# EAGLE design eki-igep (EAGLE 5.10)
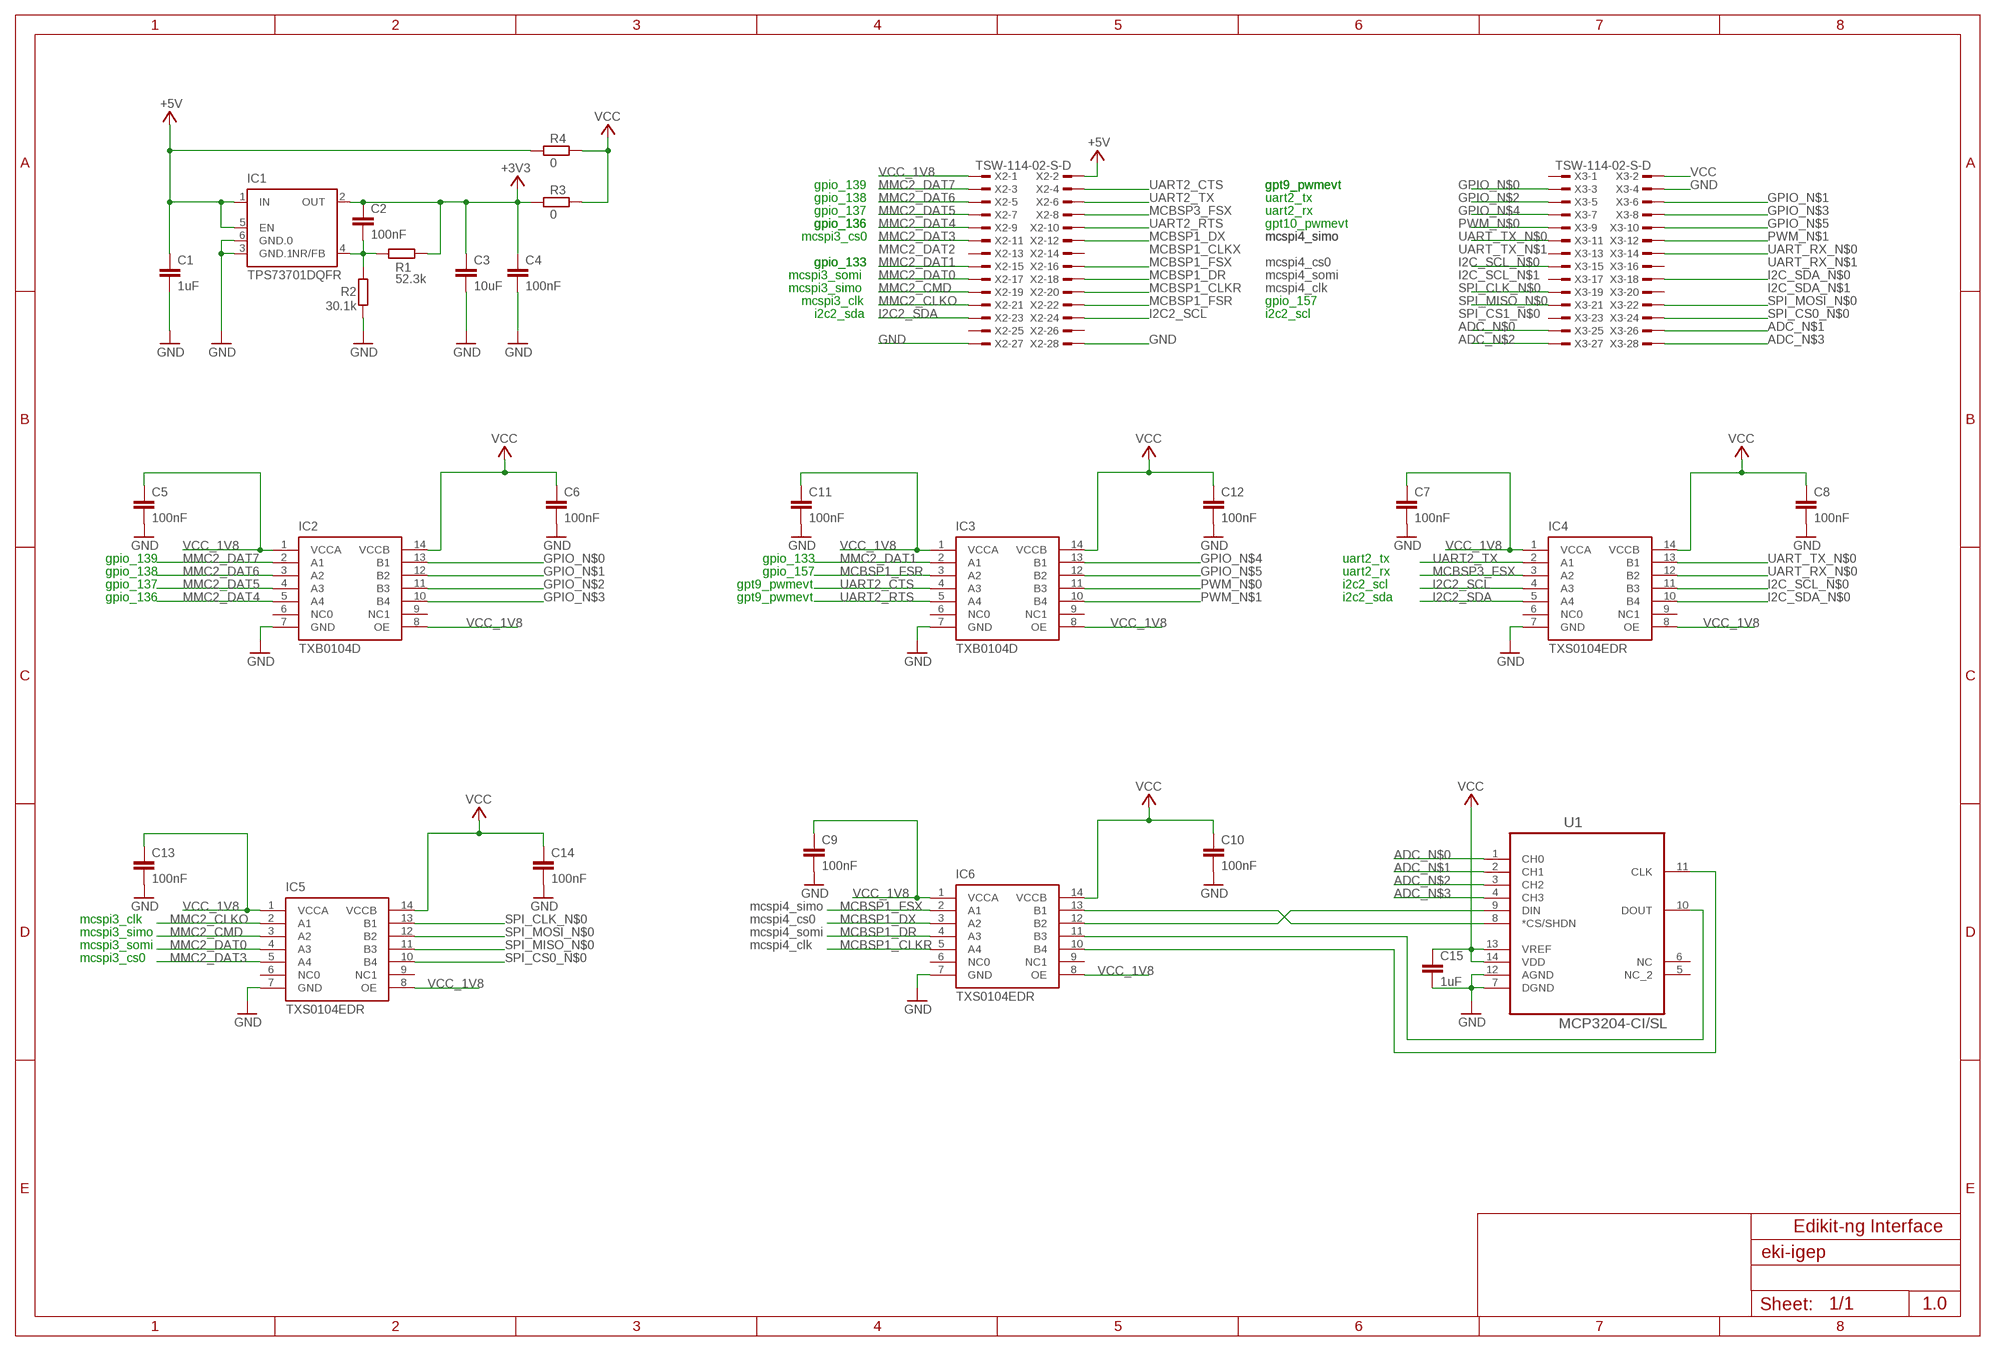
[diagram p0: schematic, sheet 1]

## Parts
C1  1uF  C-EUC0805  [C0805]
C2  100nF  C-EUC0805  [C0805]
C3  10uF  C-EUC0805  [C0805]
C4  100nF  C-EUC0805  [C0805]
C5  100nF  C-EUC0805  [C0805]
C6  100nF  C-EUC0805  [C0805]
C7  100nF  C-EUC0805  [C0805]
C8  100nF  C-EUC0805  [C0805]
C9  100nF  C-EUC0805  [C0805]
C10  100nF  C-EUC0805  [C0805]
C11  100nF  C-EUC0805  [C0805]
C12  100nF  C-EUC0805  [C0805]
C13  100nF  C-EUC0805  [C0805]
C14  100nF  C-EUC0805  [C0805]
C15  1uF  C-EUC0805  [C0805]
IC1  TPS73701DQFR  [SOT223-6]
IC2  TXB0104D  [D_R-PDSO-G14]
IC3  TXB0104D  [D_R-PDSO-G14]
IC4  TXS0104EDR  [D_R-PDSO-G14]
IC5  TXS0104EDR  [D_R-PDSO-G14]
IC6  TXS0104EDR  [D_R-PDSO-G14]
R1  52.3k  R-EU_R1206  [R1206]
R2  30.1k  R-EU_R1206  [R1206]
R3  0  R-EU_R1206  [R1206]
R4  0  R-EU_R1206  [R1206]
U1  MCP3204-CI/SL  [SOIC127P600X175-14N]
X2  TSW-114-02-S-D  [TSW-114-02-S-D]
X3  TSW-114-02-S-D  [TSW-114-02-S-D]

## Nets
+3V3: C2.2 C3.1 C4.1 IC1.2(OUT) R1.2 R3.1
+5V: C1.1 IC1.1(IN) IC1.5(EN) R4.1 X2.2
ADC_N$0: U1.1(CH0) X3.25
ADC_N$1: U1.2(CH1) X3.26
ADC_N$2: U1.3(CH2) X3.27
ADC_N$3: U1.4(CH3) X3.28
GND: C1.2 C3.2 C4.2 C5.2 C6.2 C7.2 C8.2 C9.2 C10.2 C11.2 C12.2 C13.2 C14.2 C15.2 IC1.3(GND.1) IC1.6(GND.0) IC2.7(GND) IC3.7(GND) IC4.7(GND) IC5.7(GND) IC6.7(GND) R2.1 U1.7(DGND) U1.12(AGND) X2.27 X2.28 X3.4
GPIO_N$0: IC2.13(B1) X3.3
GPIO_N$1: IC2.12(B2) X3.6
GPIO_N$2: IC2.11(B3) X3.5
GPIO_N$3: IC2.10(B4) X3.8
GPIO_N$4: IC3.13(B1) X3.7
GPIO_N$5: IC3.12(B2) X3.10
I2C2_SCL: IC4.4(A3) X2.24
I2C2_SDA: IC4.5(A4) X2.23
I2C_SCL_N$0: IC4.11(B3) X3.15
I2C_SDA_N$0: IC4.10(B4) X3.18
MCBSP1_CLKR: IC6.5(A4) X2.20
MCBSP1_DR: IC6.4(A3) X2.18
MCBSP1_DX: IC6.3(A2) X2.12
MCBSP1_FSR: IC3.3(A2) X2.22
MCBSP1_FSX: IC6.2(A1) X2.16
MCBSP3_FSX: IC4.3(A2) X2.8
MMC2_CLKO: IC5.2(A1) X2.21
MMC2_CMD: IC5.3(A2) X2.19
MMC2_DAT0: IC5.4(A3) X2.17
MMC2_DAT1: IC3.2(A1) X2.15
MMC2_DAT3: IC5.5(A4) X2.11
MMC2_DAT4: IC2.5(A4) X2.9
MMC2_DAT5: IC2.4(A3) X2.7
MMC2_DAT6: IC2.3(A2) X2.5
MMC2_DAT7: IC2.2(A1) X2.3
N$1: C2.1 IC1.4(NR/FB) R1.1 R2.2
N$2: IC6.13(B1) U1.8(*CS/SHDN)
N$3: IC6.12(B2) U1.9(DIN)
N$18: IC6.11(B3) U1.10(DOUT)
N$19: IC6.10(B4) U1.11(CLK)
PWM_N$0: IC3.11(B3) X3.9
PWM_N$1: IC3.10(B4) X3.12
SPI_CLK_N$0: IC5.13(B1) X3.19
SPI_CS0_N$0: IC5.10(B4) X3.24
SPI_MISO_N$0: IC5.11(B3) X3.21
SPI_MOSI_N$0: IC5.12(B2) X3.22
UART2_CTS: IC3.4(A3) X2.4
UART2_RTS: IC3.5(A4) X2.10
UART2_TX: IC4.2(A1) X2.6
UART_RX_N$0: IC4.12(B2) X3.14
UART_TX_N$0: IC4.13(B1) X3.11
VCC: C6.1 C8.1 C10.1 C12.1 C14.1 C15.1 IC2.14(VCCB) IC3.14(VCCB) IC4.14(VCCB) IC5.14(VCCB) IC6.14(VCCB) R3.2 R4.2 U1.13(VREF) U1.14(VDD) X3.2
VCC_1V8: C5.1 C7.1 C9.1 C11.1 C13.1 IC2.1(VCCA) IC2.8(OE) IC3.1(VCCA) IC3.8(OE) IC4.1(VCCA) IC4.8(OE) IC5.1(VCCA) IC5.8(OE) IC6.1(VCCA) IC6.8(OE) X2.1
Unconnected: IC2.6(NC0) IC2.9(NC1) IC3.6(NC0) IC3.9(NC1) IC4.6(NC0) IC4.9(NC1) IC5.6(NC0) IC5.9(NC1) IC6.6(NC0) IC6.9(NC1) U1.5(NC_2) U1.6(NC) X2.13 X2.14 X2.25 X2.26 X3.1 X3.13 X3.16 X3.17 X3.20 X3.23

## Notes on the sheet
- gpio_139 | gpt9_pwmevt | gpt9_pwmevt
- gpio_138 | uart2_tx
- gpio_137 | uart2_rx
- gpio_136 | gpio_136 | gpt10_pwmevt
- mcspi3_cs0 | mcspi4_simo | mcspi4_simo
- MMC2_DAT2 | MCBSP1_CLKX | UART_TX_N$1
- gpio_133 | gpio_133 | mcspi4_cs0 | UART_RX_N$1
- mcspi3_somi | mcspi4_somi | I2C_SCL_N$1
- mcspi3_simo | mcspi4_clk | I2C_SDA_N$1
- mcspi3_clk | gpio_157
- i2c2_sda | i2c2_scl | SPI_CS1_N$0
- gpio_139 | gpio_133 | uart2_tx
- gpio_138 | gpio_157 | uart2_rx
- gpio_137 | gpt9_pwmevt | i2c2_scl
- gpio_136 | gpt9_pwmevt | i2c2_sda
- mcspi4_simo
- mcspi3_clk | mcspi4_cs0
- mcspi3_simo | mcspi4_somi
- mcspi3_somi | mcspi4_clk
- mcspi3_cs0
- Edikit-ng Interface
- 1.0

## Library data of the parts
C1-C15 = resistor:C-EU: CAPACITOR, European symbol
IC1 = mydesign:TPS737*: 1A LOW-DROPOUT REGULATOR WITH REVERSE CURRENT DETECTION Single Output LDO, 1A, Adj. (1.2 to 5.0V), Reverse Current Protection Source: http://www.ti.com/lit/ds/symlink/tps73701.pdf
IC2 IC3 = design:TXB0104: 4-BIT BIDIRECTIONAL VOLTAGE-LEVEL TRANSLATOR With auto-direction sensing and 15-kV ESD protection
IC4-IC6 = design:TXS0104: 4-BIT BIDIRECTIONAL VOLTAGE-LEVEL TRANSLATOR For open-drain and push-pull applications
R1-R4 = resistor:R-EU_: RESISTOR, European symbol
U1 = design:MCP3204-CI/SL: IC ADC 12BIT 2.7V 4CH SPI; MPN: MCP3204-CI/SL; OC_FARNELL: 1196795; OC_NEWARK: 26M1276; PACKAGE: 14 - SOIC; SUPPLIER: Microchip
X2 X3 = con-samtec:TSW-114-02-S-D: THROUGH-HOLE .025" SQ POST HEADER Source: Samtec TSW.pdf

## Board
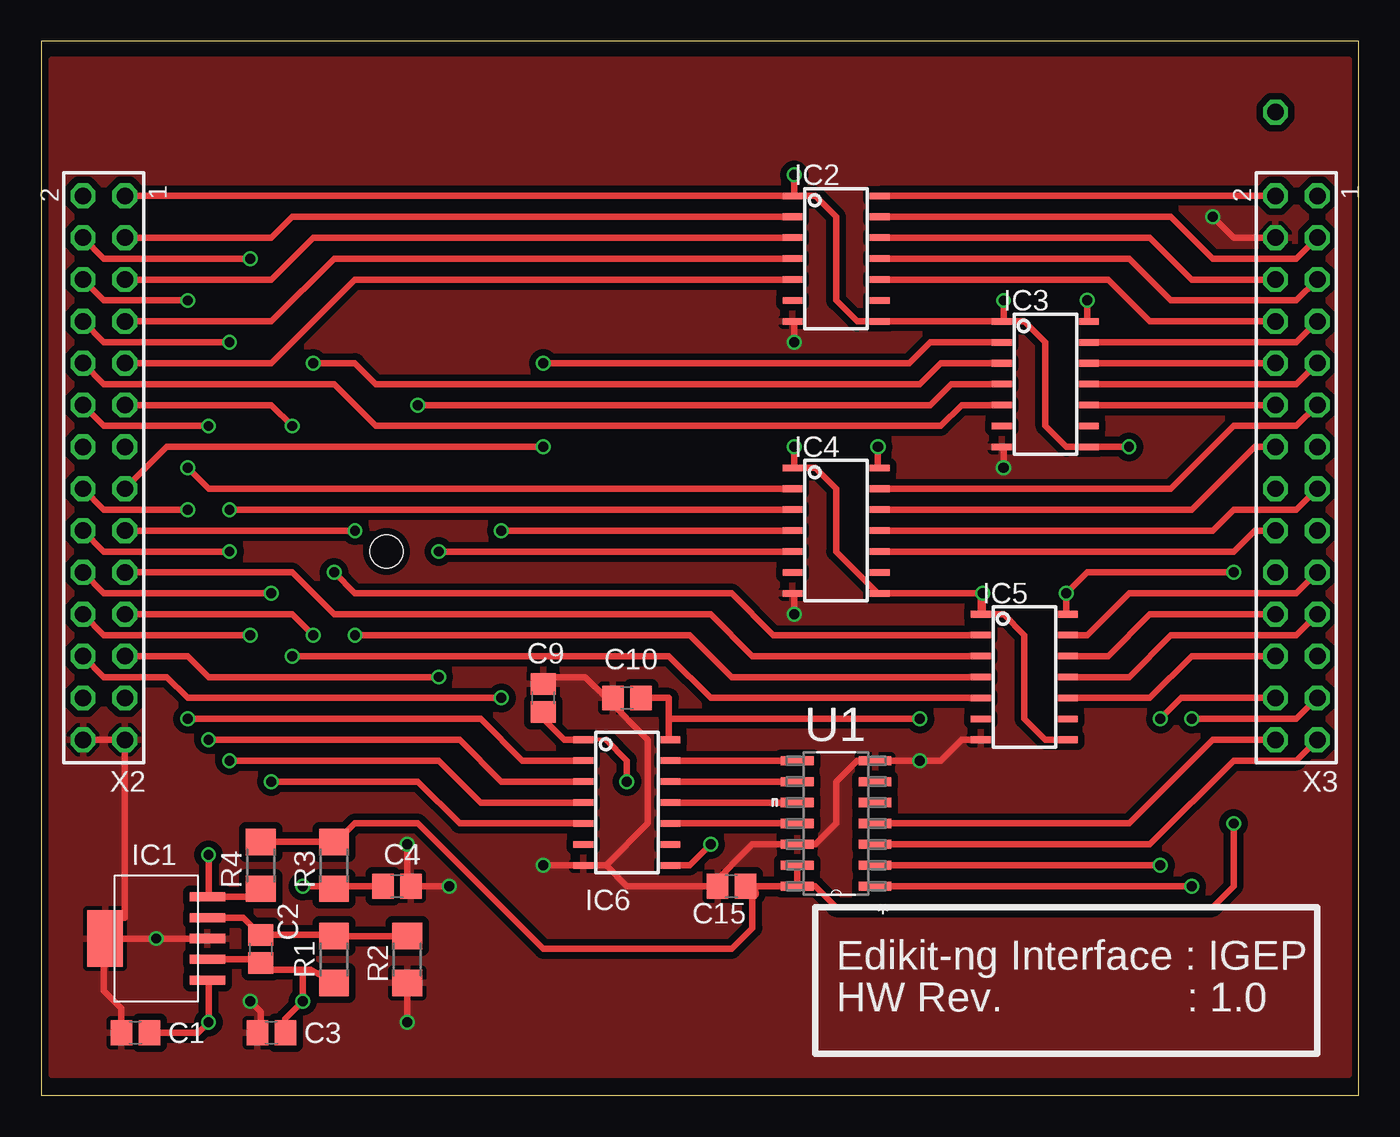
[diagram p1: board, top side]
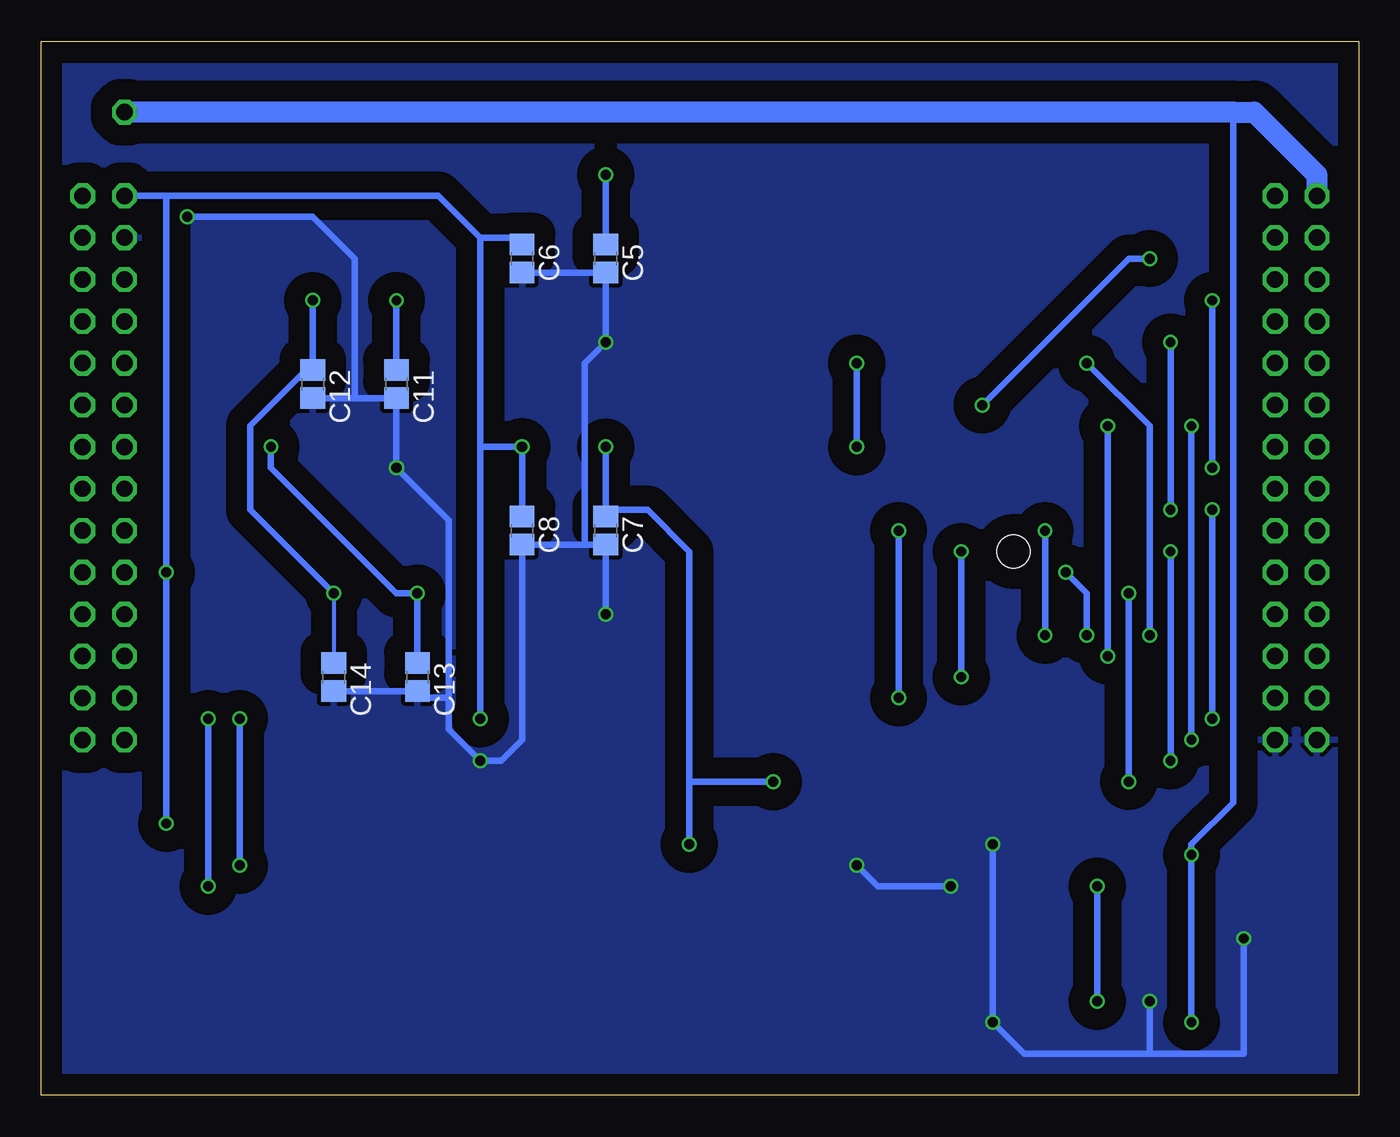
[diagram p2: board, bottom side, seen from below]

Size 79.99 x 64 mm. Coordinates in mm from the lower left corner, seen from the top.
Outline: 0,0 79.99,0 79.99,64 0,64 0,0
Copper layers (1*16): Top 0.035mm / dielectric 1.5mm / Bottom 0.035mm
Design rules "ITeadStudio": minimum track width 6mil, minimum drill 12mil, track to track 6mil, track to pad 6mil, pad to pad 6mil, via to via 6mil, smd to smd 0mil, copper to edge 10mil, drill to drill 10mil, minimum pad ring 10mil, minimum via ring 6mil, stop-mask expansion 2mil, vias tented up to drill 100mil, thermal gap 10mil
Holes 2 mm at 20.95,33.02

### Footprints (pad centres in the part's own frame; a part is rotated, then mirrored left to right if it is on the bottom)
C0805 = smd 1.3 x 1.5: 1 -0.85,0; 2 0.85,0
SOT223-6 = smd 0.55 x 2.15: 1 -2.54,-3.1; 2 -1.27,-3.1; 3 0,-3.1; 4 1.27,-3.1; 5 2.54,-3.1 | smd 3.45 x 2.15: 6 0,3.1
D_R-PDSO-G14 = smd 0.4 x 1.2: 1 -3.81,-2.65; 2 -2.54,-2.65; 3 -1.27,-2.65; 4 0,-2.65; 5 1.27,-2.65; 6 2.54,-2.65; 7 3.81,-2.65; 8 3.81,2.65; 9 2.54,2.65; 10 1.27,2.65; 11 0,2.65; 12 -1.27,2.65; 13 -2.54,2.65; 14 -3.81,2.65
R1206 = smd 1.6 x 1.803: 1 -1.422,0; 2 1.422,0
SOIC127P600X175-14N = smd 1.981 x 0.559: 1 -2.362,3.81; 2 -2.362,2.54; 3 -2.362,1.27; 4 -2.362,0; 5 -2.362,-1.27; 6 -2.362,-2.54; 7 -2.362,-3.81; 8 2.362,-3.81; 9 2.362,-2.54; 10 2.362,-1.27; 11 2.362,0; 12 2.362,1.27; 13 2.362,2.54; 14 2.362,3.81
TSW-114-02-S-D = drill 1 pad 1.5 octagon: 1 16.51,-1.27; 2 16.51,1.27; 3 13.97,-1.27; 4 13.97,1.27; 5 11.43,-1.27; 6 11.43,1.27; 7 8.89,-1.27; 8 8.89,1.27; 9 6.35,-1.27; 10 6.35,1.27; 11 3.81,-1.27; 12 3.81,1.27; 13 1.27,-1.27; 14 1.27,1.27; 15 -1.27,-1.27; 16 -1.27,1.27; 17 -3.81,-1.27; 18 -3.81,1.27; 19 -6.35,-1.27; 20 -6.35,1.27; 21 -8.89,-1.27; 22 -8.89,1.27; 23 -11.43,-1.27; 24 -11.43,1.27; 25 -13.97,-1.27; 26 -13.97,1.27; 27 -16.51,-1.27; 28 -16.51,1.27

### Placement (x,y rotation side)
C1  5.71,3.81 180 top
C2  13.34,8.89 270 top
C3  13.97,3.81 180 top
C4  21.59,12.7 0 top
C5  45.72,50.8 270 bottom
C6  50.8,50.8 270 bottom
C7  45.72,34.29 270 bottom
C8  50.8,34.29 270 bottom
C9  30.48,24.13 90 top
C10  35.56,24.13 180 top
C11  58.42,43.18 270 bottom
C12  63.5,43.18 270 bottom
C13  57.15,25.4 270 bottom
C14  62.23,25.4 270 bottom
C15  41.91,12.7 180 top
IC1  6.99,9.53 90 top
IC2  48.26,50.8 270 top
IC3  60.96,43.18 270 top
IC4  48.26,34.29 270 top
IC5  59.69,25.4 270 top
IC6  35.56,17.78 270 top
R1  17.78,8.26 270 top
R2  22.23,8.26 90 top
R3  17.78,13.97 90 top
R4  13.34,13.97 90 top
U1  48.26,16.51 180 top
X2  3.81,38.1 90 top
X3  76.2,38.1 90 top

### Tracks (layer width: path | path; a pad name or v marks a point on that pad's centre or on a via)
+3V3  (via drill 0.6)
  Top 0.406: IC1.2 13.34,8.26 C2.2 13.34,7.62 15.88,7.62 | 15.88,7.62 16.36,7.62 R1.2 | v15.88,12.7 17.78,12.7 R3.1 17.93,12.7 C4.1 | 15.88,7.62 v15.88,5.71 14.82,4.66 C3.1
  Bottom 0.406: v15.88,5.71 v15.88,12.7
+5V  (via drill 0.6, 1)
  Top 0.406: IC1.1 10.16,6.99 v10.16,4.45 9.53,3.81 C1.1 | v10.16,14.61 10.16,12.06 | 10.16,12.06 IC1.5 | 10.16,12.06 12.7,12.06 12.7,12.55 R4.1
  Bottom 0.406: v10.16,4.45 v10.16,14.61 10.16,15.24 7.62,17.78 7.62,59.69
  Bottom 1.27: v74.93,59.69 7.62,59.69 6.35,59.69 2.54,55.88 X2.2
ADC_N$0  (via drill 0.6)
  Top 0.406: X3.25 76.2,22.86 v69.85,22.86 | U1.1 v69.85,12.7
  Bottom 0.406: v69.85,12.7 v69.85,22.86
ADC_N$1  (via drill 0.6)
  Top 0.406: X3.26 69.22,24.13 v67.94,22.86 | U1.2 v67.94,13.97
  Bottom 0.406: v67.94,13.97 v67.94,22.86
ADC_N$2
  Top 0.406: X3.27 76.2,20.32 72.39,20.32 67.31,15.24 U1.3
ADC_N$3
  Top 0.406: X3.28 71.12,21.59 66.04,16.51 U1.4
GND  (via drill 0.6, 0.61)
  Top 0.254: 57.15,21.59 IC5.7 | 49.53,20.32 U1.7 | 45.72,30.48 IC4.7 | 45.72,46.99 IC2.7 | 40.64,12.7 C15.2 | 30.48,25.4 C9.2 | IC6.7 33.02,13.97 | 34.29,24.13 C10.2
  Top 0.406: IC3.7 58.42,39.37 v58.42,38.1 | X2.28 X2.27 5.08,10.79 3.81,10.79 3.81,9.6 IC1.6 | 57.15,21.59 55.88,21.59 54.61,20.32 v53.34,20.32 U1.7 | 49.53,20.32 48.26,19.05 48.26,16.51 46.99,15.24 U1.12 43.18,15.24 40.64,12.7 35.56,12.7 34.29,13.97 | v45.72,29.21 45.72,30.48 | v45.72,45.72 45.72,46.99 | 30.48,25.4 33.02,25.4 34.29,24.13 36.83,21.59 36.83,16.51 34.29,13.97 | 33.02,13.97 34.29,13.97 | X3.4 72.39,52.07 v71.12,53.34 | C1.2 4.87,5.29 3.81,6.35 3.81,9.45 IC1.6 | v22.23,4.45 R2.1 | C3.2 13.34,3.81 13.34,5.08 v12.7,5.71 | v22.23,15.24 22.23,12.7 C4.2 v24.77,12.7 | IC1.6 v6.99,9.53 IC1.3 | v30.48,13.97 IC6.7
  Bottom 0.254: 57.15,24.13 C13.2 | C7.2 45.72,33.02
  Bottom 0.406: 60.96,42.33 C11.2 v58.42,38.1 55.24,34.92 55.24,24.13 | 60.96,42.33 C12.2 | 46.99,33.44 C8.2 50.8,21.59 52.07,20.32 v53.34,20.32 55.24,22.23 55.24,24.13 | 46.99,33.44 C7.2 | C6.2 C5.2 v45.72,45.72 46.99,44.45 46.99,33.44 | C13.2 C14.2 | 55.24,24.13 57.15,24.13 | 45.72,33.02 v45.72,29.21 | 60.96,42.33 60.96,50.8 63.5,53.34 v71.12,53.34 | 12.7,2.54 15.88,2.54 20.32,2.54 v22.23,4.45 v22.23,15.24 | 12.7,2.54 v12.7,5.71 | v6.99,9.53 6.99,2.54 12.7,2.54 | v24.77,12.7 29.21,12.7 v30.48,13.97
  pour Top (isolate 0.406): 0.64,1.27 79.38,1.27 79.38,62.87 0.64,62.87
  pour Bottom (isolate 1.27): 0.64,1.27 79.38,1.27 79.38,62.87 0.64,62.87
GPIO_N$0
  Top 0.406: X3.3 76.2,50.8 71.12,50.8 68.58,53.34 IC2.13
GPIO_N$1
  Top 0.406: IC2.12 67.31,52.07 69.85,49.53 X3.6
GPIO_N$2
  Top 0.406: X3.5 76.2,48.26 68.58,48.26 66.04,50.8 IC2.11
GPIO_N$3
  Top 0.406: IC2.10 64.77,49.53 67.31,46.99 X3.8
GPIO_N$4
  Top 0.406: X3.7 76.2,45.72 IC3.13
GPIO_N$5
  Top 0.406: IC3.12 X3.10
I2C2_SCL  (via drill 0.6)
  Top 0.406: X2.24 3.81,25.4 7.62,25.4 8.89,24.13 v27.94,24.13 | v27.94,34.29 IC4.4
  Bottom 0.406: v27.94,24.13 v27.94,34.29
I2C2_SDA  (via drill 0.6)
  Top 0.406: X2.23 8.89,26.67 10.16,25.4 v24.13,25.4 | v24.13,33.02 IC4.5
  Bottom 0.406: v24.13,25.4 v24.13,33.02
I2C_SCL_N$0
  Top 0.406: X3.15 76.2,35.56 72.39,35.56 71.12,34.29 IC4.11
I2C_SDA_N$0
  Top 0.406: X3.18 73.66,34.29 72.39,33.02 IC4.10
MCBSP1_CLKR  (via drill 0.6)
  Top 0.254: IC6.5 33.02,16.51
  Top 0.406: v13.97,30.48 3.81,30.48 X2.20 | v13.97,19.05 22.86,19.05 25.4,16.51 IC6.5
  Bottom 0.406: v13.97,19.05 v13.97,30.48
MCBSP1_DR  (via drill 0.6)
  Top 0.254: IC6.4 33.02,17.78
  Top 0.406: v11.43,33.02 3.81,33.02 X2.18 | IC6.4 26.67,17.78 24.13,20.32 v11.43,20.32
  Bottom 0.406: v11.43,20.32 v11.43,33.02
MCBSP1_DX  (via drill 0.6)
  Top 0.254: IC6.3 33.02,19.05
  Top 0.406: X2.12 3.81,40.64 v10.16,40.64 | IC6.3 27.94,19.05 25.4,21.59 v10.16,21.59
  Bottom 0.406: v10.16,21.59 v10.16,40.64
MCBSP1_FSR  (via drill 0.6)
  Top 0.406: IC3.3 54.61,44.45 53.34,43.18 20.32,43.18 19.05,44.45 v16.51,44.45 | X2.22 3.81,27.94 v12.7,27.94
  Bottom 0.406: v12.7,27.94 12.7,40.64 v16.51,44.45
MCBSP1_FSX  (via drill 0.6)
  Top 0.254: IC6.2 33.02,20.32
  Top 0.406: X2.16 3.81,35.56 v8.89,35.56 | v8.89,22.86 26.67,22.86 29.21,20.32 IC6.2
  Bottom 0.406: v8.89,22.86 v8.89,35.56
MCBSP3_FSX  (via drill 0.6)
  Top 0.406: X2.8 3.81,45.72 v11.43,45.72 | v11.43,35.56 IC4.3
  Bottom 0.406: v11.43,35.56 v11.43,45.72
MMC2_CLKO  (via drill 0.6)
  Top 0.406: IC5.2 44.45,27.94 41.91,30.48 19.05,30.48 v17.78,31.75 | X2.21 15.24,29.21 v16.51,27.94
  Bottom 0.406: v16.51,27.94 16.51,30.48 v17.78,31.75
MMC2_CMD
  Top 0.406: IC5.3 43.18,26.67 40.64,29.21 17.78,29.21 15.24,31.75 X2.19
MMC2_DAT0  (via drill 0.6)
  Top 0.406: IC5.4 41.91,25.4 39.37,27.94 v19.05,27.94 | X2.17 v19.05,34.29
  Bottom 0.406: v19.05,34.29 v19.05,27.94
MMC2_DAT1  (via drill 0.6)
  Top 0.406: IC3.2 53.98,45.72 52.7,44.45 v30.48,44.45 | X2.15 7.62,39.37 v30.48,39.37
  Bottom 0.406: v30.48,39.37 v30.48,44.45
MMC2_DAT3  (via drill 0.6)
  Top 0.406: IC5.5 40.64,24.13 38.1,26.67 v15.24,26.67 | v15.24,40.64 13.97,41.91 X2.11
  Bottom 0.406: v15.24,26.67 v15.24,40.64
MMC2_DAT4
  Top 0.406: IC2.5 19.05,49.53 13.97,44.45 X2.9
MMC2_DAT5
  Top 0.406: IC2.4 17.78,50.8 13.97,46.99 X2.7
MMC2_DAT6
  Top 0.406: IC2.3 16.51,52.07 13.97,49.53 X2.5
MMC2_DAT7
  Top 0.406: IC2.2 15.24,53.34 13.97,52.07 X2.3
N$1
  Top 0.406: IC1.4 12.28,10.79 C2.1 17.08,9.74 R1.1 R2.2
N$2
  Top 0.254: IC6.13 38.1,20.32
  Top 0.406: IC6.13 U1.8
N$3
  Top 0.254: IC6.12 38.1,19.05
  Top 0.406: IC6.12 U1.9
N$18
  Top 0.254: IC6.11 38.1,17.78
  Top 0.406: IC6.11 U1.10
N$19
  Top 0.254: IC6.10 38.1,16.51
  Top 0.406: IC6.10 U1.11
PWM_N$0
  Top 0.406: X3.9 76.2,43.18 IC3.11
PWM_N$1
  Top 0.406: IC3.10 X3.12
SPI_CLK_N$0
  Top 0.406: X3.19 76.2,30.48 66.04,30.48 63.5,27.94 IC5.13
SPI_CS0_N$0
  Top 0.406: X3.24 69.85,26.67 67.31,24.13 IC5.10
SPI_MISO_N$0
  Top 0.406: X3.21 76.2,27.94 68.58,27.94 66.04,25.4 IC5.11
SPI_MOSI_N$0
  Top 0.406: X3.22 67.31,29.21 64.77,26.67 IC5.12
UART2_CTS  (via drill 0.6)
  Top 0.406: IC3.4 55.24,43.18 53.98,41.91 v22.86,41.91 | X2.4 3.81,50.8 v12.7,50.8
  Bottom 0.406: v12.7,50.8 13.97,50.8 v22.86,41.91
UART2_RTS
  Top 0.406: IC3.5 55.88,41.91 54.61,40.64 20.32,40.64 17.78,43.18 3.81,43.18 X2.10
UART2_TX  (via drill 0.6)
  Top 0.406: X2.6 3.81,48.26 v8.89,48.26 | v8.89,38.1 10.16,36.83 IC4.2
  Bottom 0.406: v8.89,38.1 v8.89,48.26
UART_RX_N$0
  Top 0.406: X3.14 73.66,39.37 69.85,35.56 IC4.12
UART_TX_N$0
  Top 0.406: X3.11 76.2,40.64 72.39,40.64 68.58,36.83 IC4.13
VCC  (via drill 0.6, 0.61)
  Top 0.254: 38.1,21.59 IC6.14 | 50.8,38.1 IC4.14 | IC2.14 50.8,54.61 | 63.5,46.99 IC3.14 | 45.72,12.7 U1.14 | 62.23,29.21 IC5.14
  Top 0.406: U1.14 U1.13 | 38.1,22.86 38.1,24.13 C10.1 | 38.1,22.86 38.1,21.59 | v50.8,39.37 50.8,38.1 | v53.34,22.86 38.1,22.86 | X3.2 IC2.14 | v63.5,48.26 63.5,46.99 | C15.1 45.72,12.7 46.99,12.7 48.26,11.43 71.12,11.43 72.39,12.7 v72.39,16.51 | 62.23,29.21 v62.23,30.48 63.5,31.75 v72.39,31.75 | R4.2 R3.2 | 17.93,15.39 19.05,16.51 22.86,16.51 30.48,8.89 41.91,8.89 43.18,10.16 43.18,12.28
  Top 0.813: R3.2 17.93,15.39 | 43.18,12.28 C15.1
  Bottom 0.254: 50.8,52.07 C6.1 | v62.23,30.48 C14.1 | 63.5,44.45 C12.1
  Bottom 0.406: C8.1 v50.8,39.37 53.34,39.37 | 53.34,52.07 50.8,52.07 | 53.34,52.07 53.34,39.37 | 53.34,39.37 v53.34,22.86 | 53.34,52.07 55.88,54.61 72.39,54.61 | 72.39,54.61 X3.2 | v63.5,48.26 63.5,44.45 67.31,40.64 67.31,35.56 v62.23,30.48 | v72.39,16.51 v72.39,31.75 72.39,54.61
VCC_1V8  (via drill 0.6, 0.61)
  Top 0.254: 30.48,22.86 C9.1 | IC6.8 38.1,13.97 | 34.29,21.59 33.02,21.59 IC6.1
  Top 0.406: v58.42,48.26 58.42,46.99 IC3.1 | IC3.1 59.69,46.99 60.96,45.72 60.96,40.64 62.23,39.37 IC3.8 v66.04,39.37 | v45.72,39.37 45.72,38.21 IC4.1 46.99,38.1 48.26,36.83 48.26,33.02 50.8,30.48 IC4.8 v57.15,30.48 | IC2.1 46.99,54.61 48.26,53.34 48.26,48.26 49.53,46.99 IC2.8 IC3.1 | v45.72,55.88 45.72,54.72 IC2.1 | v57.15,30.48 57.15,29.32 IC5.1 | IC5.8 60.96,21.59 59.69,22.86 59.69,27.94 58.42,29.21 57.15,29.21 | 57.15,29.21 IC5.1 | v57.15,30.48 57.15,29.21 | v57.15,30.48 57.04,30.37 IC5.1 | IC2.1 X2.1 | 33.02,21.59 31.75,21.59 30.48,22.86 | IC6.8 39.37,13.97 v40.64,15.24 | v35.56,19.05 35.56,20.32 34.29,21.59
  Bottom 0.406: v58.42,48.26 C11.1 | 45.72,35.56 v45.72,39.37 | 45.72,35.56 C7.1 | v45.72,55.88 C5.1 | C13.1 v57.15,30.48 58.42,30.48 66.04,38.1 v66.04,39.37 | 40.64,19.05 40.64,33.02 43.18,35.56 45.72,35.56 | v40.64,15.24 40.64,19.05 | 40.64,19.05 v35.56,19.05

### Text on the board
tNames: Edikit-ng Interface : IGEP | HW Rev. : 1.0